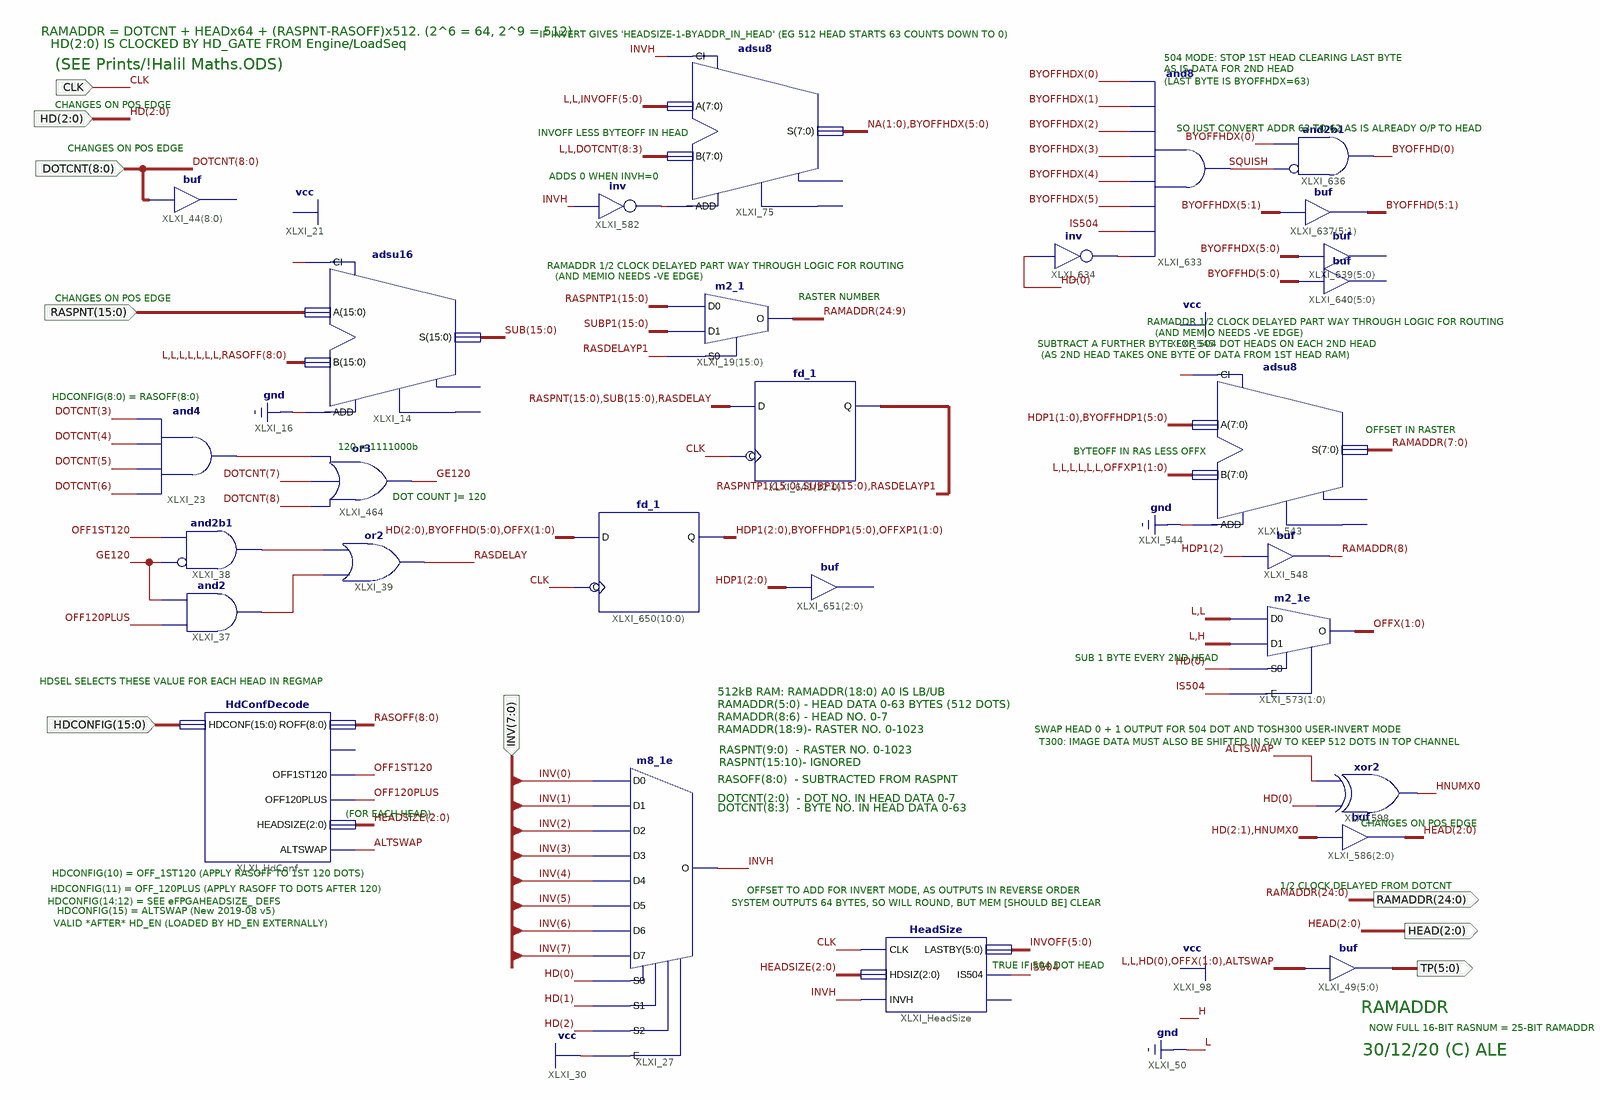
[diagram p0: schematic sheet 1]
// Xilinx ISE schematic RamAddr.sch (spartan3e) as structural Verilog: 28 symbols, 9 ports
module RamAddr (
  input  [15:0] RASPNT,
  input  CLK,
  input  [2:0] HD,
  input  [8:0] DOTCNT,
  input  [7:0] INV,
  input  [15:0] HDCONFIG,
  output [2:0] HEAD,
  output [5:0] TP,
  output [24:0] RAMADDR
);

  wire ALTSWAP, GE120, HNUMX0, INVH, IS504, OFF1ST120, OFF120PLUS, RASDELAY, RASDELAYP1, SQUISH, XLXN_130,
       XLXN_508, XLXN_511, XLXN_658, XLXN_906;
  wire [1:0] NA, OFFX, OFFXP1;
  wire [2:0] HDP1, HEADSIZE;
  wire [5:0] BYOFFHD, BYOFFHDP1, BYOFFHDX, INVOFF;
  wire [8:0] RASOFF;
  wire [15:0] RASPNTP1, SUB, SUBP1;

  and XLXI_23 (XLXN_130, DOTCNT[6], DOTCNT[5], DOTCNT[4], DOTCNT[3]);
  or XLXI_464 (GE120, DOTCNT[8], DOTCNT[7], XLXN_130);
  and XLXI_38 (XLXN_508, ~GE120, OFF1ST120);  // and2b1
  and XLXI_37 (XLXN_511, GE120, OFF120PLUS);
  or XLXI_39 (RASDELAY, XLXN_508, XLXN_511);
  assign TP = {2'b00, HD[0], OFFX, ALTSWAP};  // buf XLXI_49[5..0], 6 bits wide
  adsu8 XLXI_75 (
    .A({2'b00, INVOFF}), .ADD(XLXN_658), .B({2'b00, DOTCNT[8:3]}), .CI(INVH), .S({NA, BYOFFHDX}));  // open: CO, OFL
  not XLXI_582 (XLXN_658, INVH);
  adsu8 XLXI_543 (
    .A({HDP1[1:0], BYOFFHDP1}), .ADD(1'b0), .B({{6{1'b0}}, OFFXP1}), .CI(1'b1), .S(RAMADDR[7:0]));  // open: CO, OFL
  buf XLXI_548 (RAMADDR[8], HDP1[2]);
  m2_1e XLXI_573[1:0] (.D0(2'b00), .D1(2'b01), .E(IS504), .S0(HD[0]), .O(OFFX));
  and XLXI_633 (SQUISH, XLXN_906, IS504, BYOFFHDX[5], BYOFFHDX[4], BYOFFHDX[3], BYOFFHDX[2], BYOFFHDX[1], BYOFFHDX[0]);
  not XLXI_634 (XLXN_906, HD[0]);
  and XLXI_636 (BYOFFHD[0], ~SQUISH, BYOFFHDX[0]);  // and2b1
  assign BYOFFHD[5:1] = BYOFFHDX[5:1];  // buf XLXI_637[5..1], 5 bits wide
  // buf XLXI_639[5..0] has open pins: I=BYOFFHDX, O=open
  // buf XLXI_640[5..0] has open pins: I=BYOFFHD, O=open
  fd_1 XLXI_641[32:0] (.C(CLK), .D({RASPNT, SUB, RASDELAY}), .Q({RASPNTP1, SUBP1, RASDELAYP1}));
  fd_1 XLXI_650[10:0] (.C(CLK), .D({HD, BYOFFHD, OFFX}), .Q({HDP1, BYOFFHDP1, OFFXP1}));
  adsu16 XLXI_14 (.A(RASPNT), .ADD(1'b0), .B({{7{1'b0}}, RASOFF}), .CI(1'b1), .S(SUB));  // open: CO, OFL
  m2_1 XLXI_19[15:0] (.D0(RASPNTP1), .D1(SUBP1), .S0(RASDELAYP1), .O(RAMADDR[24:9]));
  // buf XLXI_44[8..0] has open pins: I=DOTCNT, O=open
  m8_1e XLXI_27 (
    .D0(INV[0]), .D1(INV[1]), .D2(INV[2]), .D3(INV[3]), .D4(INV[4]), .D5(INV[5]), .D6(INV[6]), .D7(INV[7]),
    .E(1'b1), .S0(HD[0]), .S1(HD[1]), .S2(HD[2]), .O(INVH));
  HdConfDecode XLXI_HdConf (
    .ALTSWAP(ALTSWAP), .HDCONF(HDCONFIG), .HEADSIZE(HEADSIZE), .OFF120PLUS(OFF120PLUS),
    .OFF1ST120(OFF1ST120), .ROFF(RASOFF));  // open: HDCONFIG9
  assign HEAD = {HD[2:1], HNUMX0};  // buf XLXI_586[2..0], 3 bits wide
  // buf XLXI_651[2..0] has open pins: I=HDP1, O=open
  xor XLXI_598 (HNUMX0, HD[0], ALTSWAP);
  HeadSize XLXI_HeadSize (.CLK(CLK), .HDSIZ(HEADSIZE), .INVH(INVH), .IS504(IS504), .LASTBY(INVOFF));  // open: IST300

  // Notes on the sheet:
  //   RAMADDR = DOTCNT + HEADx64 + (RASPNT-RASOFF)x512. (2^6 = 64, 2^9 = 512)
  //   IF INVERT GIVES 'HEADSIZE-1-BYADDR_IN_HEAD' (EG 512 HEAD STARTS 63 COUNTS DOWN TO 0)
  //   HD(2:0) IS CLOCKED BY HD_GATE FROM Engine/LoadSeq
  //   504 MODE: STOP 1ST HEAD CLEARING LAST BYTE
  //   (SEE Prints/!Halil Maths.ODS)
  //   AS IS DATA FOR 2ND HEAD
  //   (LAST BYTE IS BYOFFHDX=63)
  //   CHANGES ON POS EDGE
  //   SO JUST CONVERT ADDR 63 TO 62 AS IS ALREADY O/P TO HEAD
  //   INVOFF LESS BYTEOFF IN HEAD
  //   CHANGES ON POS EDGE
  //   ADDS 0 WHEN INVH=0
  //   RAMADDR 1/2 CLOCK DELAYED PART WAY THROUGH LOGIC FOR ROUTING
  //   (AND MEMIO NEEDS -VE EDGE)
  //   RASTER NUMBER
  //   CHANGES ON POS EDGE
  //   RAMADDR 1/2 CLOCK DELAYED PART WAY THROUGH LOGIC FOR ROUTING
  //   (AND MEMIO NEEDS -VE EDGE)
  //   SUBTRACT A FURTHER BYTE FOR 504 DOT HEADS ON EACH 2ND HEAD
  //   (AS 2ND HEAD TAKES ONE BYTE OF DATA FROM 1ST HEAD RAM)
  //   HDCONFIG(8:0) = RASOFF(8:0)
  //   OFFSET IN RASTER
  //   120 = 1111000b
  //   BYTEOFF IN RAS LESS OFFX
  //   DOT COUNT ]= 120
  //   SUB 1 BYTE EVERY 2ND HEAD
  //   HDSEL SELECTS THESE VALUE FOR EACH HEAD IN REGMAP
  //   512kB RAM: RAMADDR(18:0) A0 IS LB/UB
  //   RAMADDR(5:0) - HEAD DATA 0-63 BYTES (512 DOTS)
  //   RAMADDR(8:6) - HEAD NO. 0-7
  //   RAMADDR(18:9)- RASTER NO. 0-1023
  //   SWAP HEAD 0 + 1 OUTPUT FOR 504 DOT AND TOSH300 USER-INVERT MODE
  //   T300: IMAGE DATA MUST ALSO BE SHIFTED IN S/W TO KEEP 512 DOTS IN TOP CHANNEL
  //   RASPNT(9:0)  - RASTER NO. 0-1023
  //   RASPNT(15:10)- IGNORED
  //   RASOFF(8:0)  - SUBTRACTED FROM RASPNT
  //   DOTCNT(2:0)  - DOT NO. IN HEAD DATA 0-7
  //   DOTCNT(8:3)  - BYTE NO. IN HEAD DATA 0-63
  //   (FOR EACH HEAD)
  //   CHANGES ON POS EDGE
  //   HDCONFIG(10) = OFF_1ST120 (APPLY RASOFF TO 1ST 120 DOTS)
  //   1/2 CLOCK DELAYED FROM DOTCNT
  //   HDCONFIG(11) = OFF_120PLUS (APPLY RASOFF TO DOTS AFTER 120)
  //   OFFSET TO ADD FOR INVERT MODE, AS OUTPUTS IN REVERSE ORDER
  //   HDCONFIG(14:12) = SEE eFPGAHEADSIZE_ DEFS
  //   SYSTEM OUTPUTS 64 BYTES, SO WILL ROUND, BUT MEM [SHOULD BE] CLEAR
  //   HDCONFIG(15) = ALTSWAP (New 2019-08 v5)
  //   VALID *AFTER* HD_EN (LOADED BY HD_EN EXTERNALLY)
  //   TRUE IF 504 DOT HEAD
  //   RAMADDR
  //   NOW FULL 16-BIT RASNUM = 25-BIT RAMADDR
  //   30/12/20 (C) ALE
endmodule
